# EAGLE design Connection (EAGLE 9.6.2)
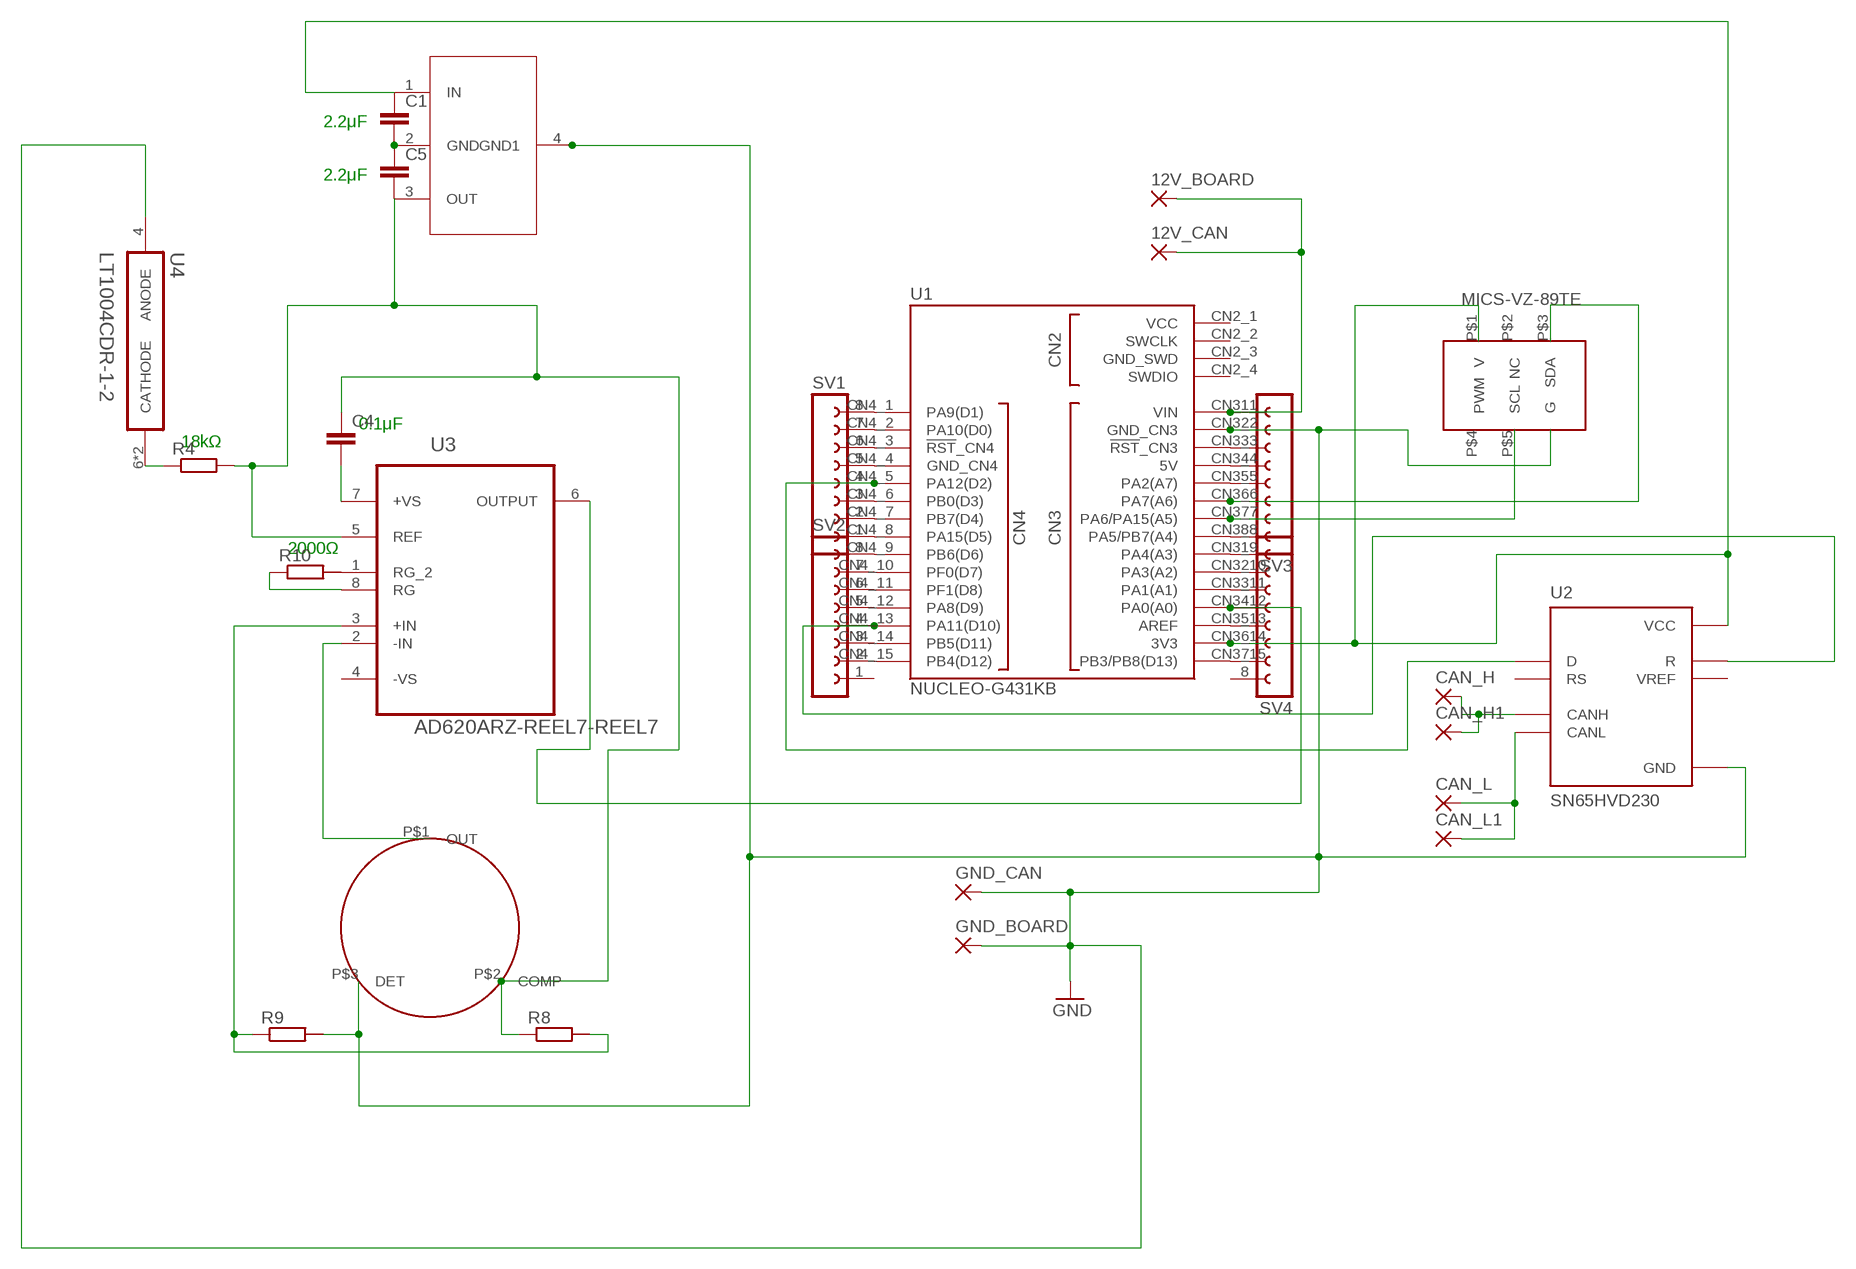
[diagram p0: schematic, sheet 1]

## Parts
12V_BOARD  1,6/0,8  [1,6/0,8]
12V_CAN  1,6/0,8  [1,6/0,8]
C1  C2,5-3  [C2.5-3]
C4  C2,5-3  [C2.5-3]
C5  C2,5-3  [C2.5-3]
CAN_H  1,6/0,8  [1,6/0,8]
CAN_H1  1,6/0,8  [1,6/0,8]
CAN_L  1,6/0,8  [1,6/0,8]
CAN_L1  1,6/0,8  [1,6/0,8]
GND_BOARD  1,6/0,8  [1,6/0,8]
GND_CAN  1,6/0,8  [1,6/0,8]
R4  R-EU_0207/10  [0207/10]
R8  R-EU_0207/10  [0207/10]
R9  R-EU_0207/10  [0207/10]
R10  R-EU_0207/10  [0207/10]
SV1  FE08-1  [FE08]
SV2  FE08-1  [FE08]
SV3  FE08-1  [FE08]
SV4  FE08-1  [FE08]
U1  NUCLEO-G431KB  [MODULE_NUCLEO-G431KB]
U2  SN65HVD230  [SOIC127P599X175-8N]
U3  AD620ARZ-REEL7-REEL7  [SOIC127P600X175-8N]
U4  LT1004CDR-1-2  [SOIC127P599X175-8N]
U$1  MP7227  [MP7227_FP]
U$2  MIC5233-3PIN  [SOT230P700X180-4N]
U$5  MICS-VZ-89TE  [MICS-VZ-89TE_FP]

## Nets
GND: GND_BOARD.1(P) GND_CAN.1(P) R9.2 SV3.2 U1.CN3_2(GND_CN3) U2.2(GND) U4.4(ANODE) U$1.P$3(DET) U$5.P$6(G)
N$1: 12V_BOARD.1(P) 12V_CAN.1(P) SV3.1 U1.CN3_1(VIN)
N$2: SV3.7 U1.CN3_7(PA6/PA15(A5)) U$5.P$5(SCL)
N$3: SV3.6 U1.CN3_6(PA7(A6)) U$5.P$3(SDA)
N$4: R4.1 U4.6(CATHODE) U4.8(CATHODE)
N$5: U3.2(-IN) U$1.P$1(OUT)
N$6: CAN_H1.1(P) CAN_H.1(P) U2.7(CANH)
N$7: CAN_L1.1(P) CAN_L.1(P) U2.6(CANL)
N$8: C1.1 SV4.6 U1.CN3_14(3V3) U2.3(VCC) U$2.1(IN) U$5.P$1(V)
N$9: SV1.4 U1.CN4_5(PA12(D2)) U2.1(D)
N$10: SV2.4 U1.CN4_13(PA11(D10)) U2.4(R)
N$11: R10.1 U3.8(RG)
N$12: C4.2 U3.7(+VS)
N$13: SV4.4 U1.CN3_12(PA0(A0)) U3.6(OUTPUT)
N$14: C5.1 U$2.2(GND)
N$15: R8.2 R9.1 U3.3(+IN)
N$16: R10.2 U3.1(RG_2)
N$17: C4.1 C5.2 R4.2 R8.1 U3.5(REF) U$1.P$2(COMP) U$2.3(OUT)
N$18: SV3.3 U1.CN3_3(!RST!_CN3)
N$19: SV3.4 U1.CN3_4(5V)
N$20: SV3.5 U1.CN3_5(PA2(A7))
N$21: SV3.8 U1.CN3_8(PA5/PB7(A4))
N$22: SV4.1 U1.CN3_9(PA4(A3))
N$23: SV4.2 U1.CN3_10(PA3(A2))
N$24: SV4.3 U1.CN3_11(PA1(A1))
N$25: SV4.5 U1.CN3_13(AREF)
N$26: SV4.7 U1.CN3_15(PB3/PB8(D13))
N$27: SV1.1 U1.CN4_8(PA15(D5))
N$28: SV1.2 U1.CN4_7(PB7(D4))
N$29: SV1.3 U1.CN4_6(PB0(D3))
N$30: SV1.5 U1.CN4_4(GND_CN4)
N$31: SV1.6 U1.CN4_3(!RST!_CN4)
N$32: SV1.7 U1.CN4_2(PA10(D0))
N$33: SV1.8 U1.CN4_1(PA9(D1))
N$34: SV2.2 U1.CN4_15(PB4(D12))
N$35: SV2.3 U1.CN4_14(PB5(D11))
N$36: SV2.5 U1.CN4_12(PA8(D9))
N$37: SV2.6 U1.CN4_11(PF1(D8))
N$38: SV2.7 U1.CN4_10(PF0(D7))
N$39: SV2.8 U1.CN4_9(PB6(D6))
N$40: C1.2 U$2.4(GND1)
Unconnected: SV2.1 SV4.8 U1.CN2_2(SWCLK) U1.CN2_4(SWDIO) U2.5(VREF) U2.8(RS) U$5.P$2(NC) U$5.P$4(PWM)

## Notes on the sheet
- 2.2μF
- 2.2μF
- 0.1μF
- 18kΩ
- 2000Ω

## Power pins joined to a net without a drawn wire
-VS: U3.4(-VS)
GND_SWD: U1.CN2_3(GND_SWD)
VCC: U1.CN2_1(VCC)

## Library data of the parts
12V_BOARD 12V_CAN CAN_H CAN_H1 CAN_L CAN_L1 GND_BOARD GND_CAN = wirepad:1,6/0,8: THROUGH-HOLE PAD
C1 C4 C5 = capacitor-wima:C: CAPACITOR naming: grid - package width
R4 R8-R10 = rcl:R-EU_: RESISTOR, European symbol; SPICEPREFIX: R
SV1-SV4 = con-lsta:FE08-1: FEMALE HEADER; OC_FARNELL: unknown; OC_NEWARK: unknown
U1 = NUCLEO-G431KB:NUCLEO-G431KB: Check availability <https://pricing.snapeda.com/parts/NUCLEO-G431KB/STMicroelectronics/view-part?ref=eda>; AVAILABILITY: In Stock; CHECK_PRICES: https://www.snapeda.com/parts/NUCLEO-G431KB/STMicroelectronics/view-part/?ref=eda; DESCRIPTION: STM32G431 Nucleo-32 STM32G4 ARM® Cortex®-M4 MCU 32-Bit Embedded Evaluation Board; MF: STMicroelectronics; MP: NUCLEO-G431KB; PACKAGE: None; PRICE: None; SNAPEDA_LINK: https://www.snapeda.com/parts/NUCLEO-G431KB/STMicroelectronics/view-part/?ref=snap
U2 = SN65HVD230:SN65HVD230: Check availability <https://pricing.snapeda.com/parts/SN65HVD230/Texas%20Instruments/view-part?ref=eda>; AVAILABILITY: In Stock; CHECK_PRICES: https://www.snapeda.com/parts/SN65HVD230/Texas+Instruments/view-part/?ref=eda; DESCRIPTION: 1/1 Transceiver Half CANbus 8-SOIC; MF: Texas Instruments; MP: SN65HVD230; PACKAGE: SOIC-8 Texas Instruments; PRICE: None; SNAPEDA_LINK: https://www.snapeda.com/parts/SN65HVD230/Texas+Instruments/view-part/?ref=snap
U3 = AD620ARZ-REEL7-REEL7:AD620ARZ-REEL7-REEL7: Check availability <https://pricing.snapeda.com/parts/AD620ARZ-REEL7/Analog%20Devices/view-part?ref=eda>; AVAILABILITY: In Stock; CHECK_PRICES: https://www.snapeda.com/parts/AD620ARZ-REEL7/Analog+Devices/view-part/?ref=eda; DESCRIPTION: Low Drift, Low Power Instrumentation Amp with Set Gains of 1 to 10000; MF: Analog Devices; MP: AD620ARZ-REEL7; PACKAGE: SOIC-8 Analog Devices; PRICE: None; PURCHASE-URL: https://www.snapeda.com/api/url_track_click_mouser/?unipart_id=48261&manufacturer=Analog Devices&part_name=AD620ARZ-REEL7&search_term=ad620; SNAPEDA_LINK: https://www.snapeda.com/parts/AD620ARZ-REEL7/Analog+Devices/view-part/?ref=snap
U4 = LT1004CDR-1-2:LT1004CDR-1-2: Check availability <https://pricing.snapeda.com/parts/LT1004CDR-1-2/Texas%20Instruments/view-part?ref=eda>; AVAILABILITY: In Stock; CHECK_PRICES: https://www.snapeda.com/parts/LT1004CDR-1-2/Texas+Instruments/view-part/?ref=eda; DESCRIPTION: 1.235-V, micropower integrated precision voltage reference; MF: Texas Instruments; MP: LT1004CDR-1-2; PACKAGE: SOIC-8 Texas Instruments; PRICE: None; SNAPEDA_LINK: https://www.snapeda.com/parts/LT1004CDR-1-2/Texas+Instruments/view-part/?ref=snap
U$1 = MP7227:MP7227
U$2 = MIC5233-3.3YS:MIC5233-3PIN
U$5 = MICS-VZ-89TE:MICS-VZ-89TE

## Board
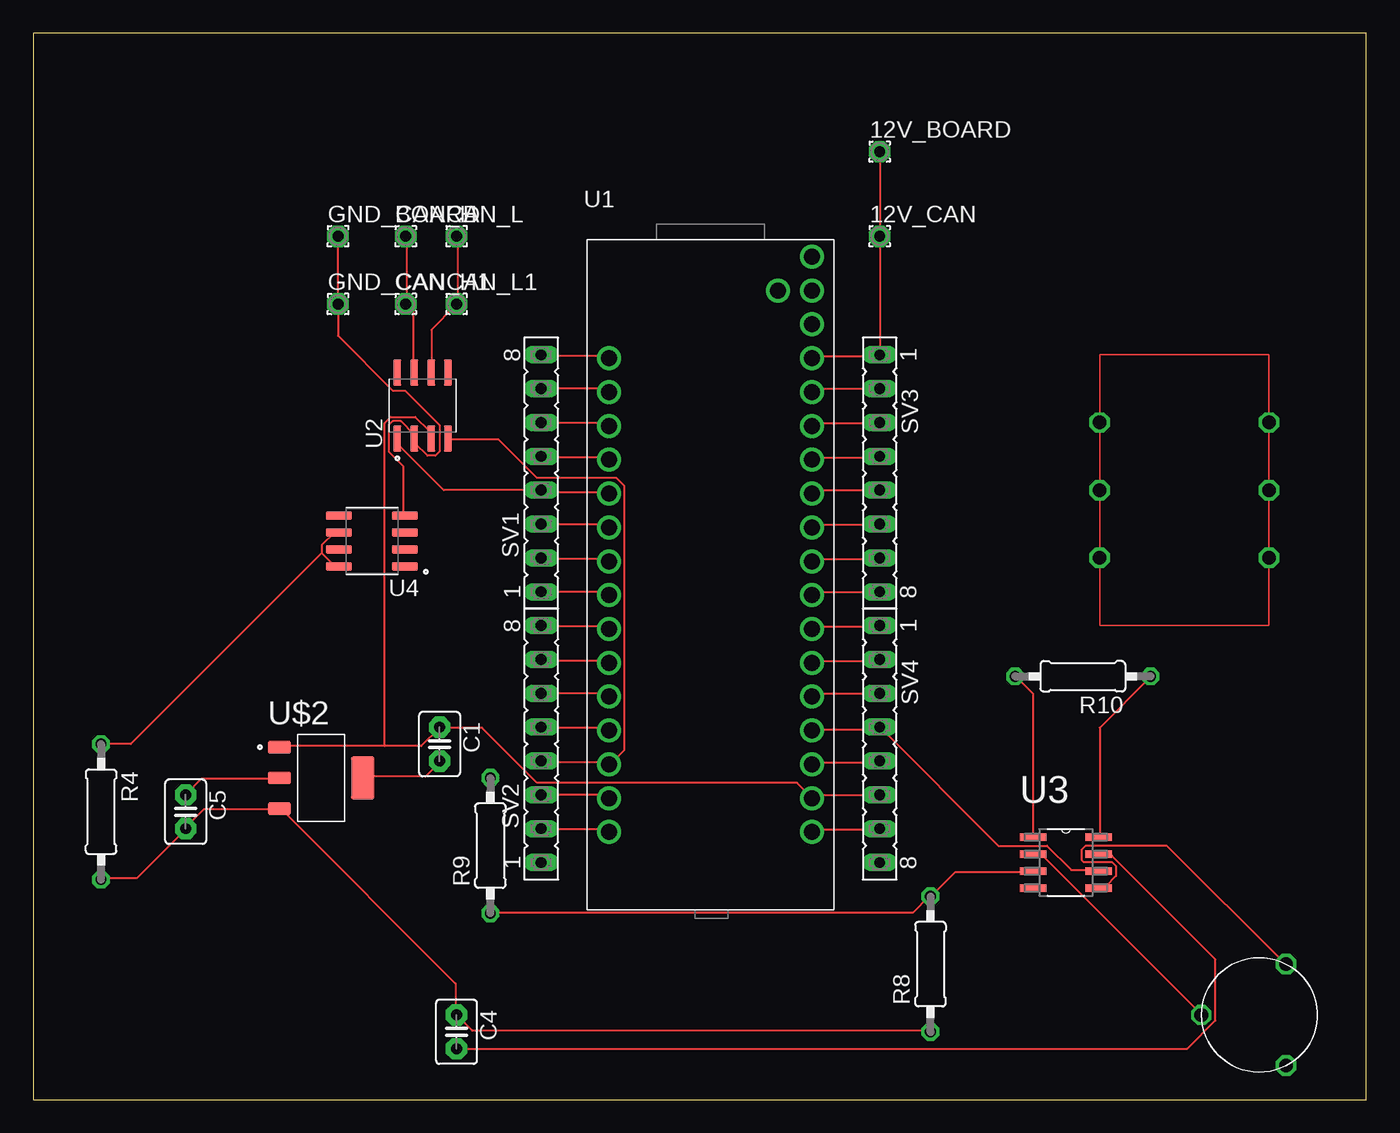
[diagram p1: board, top side]
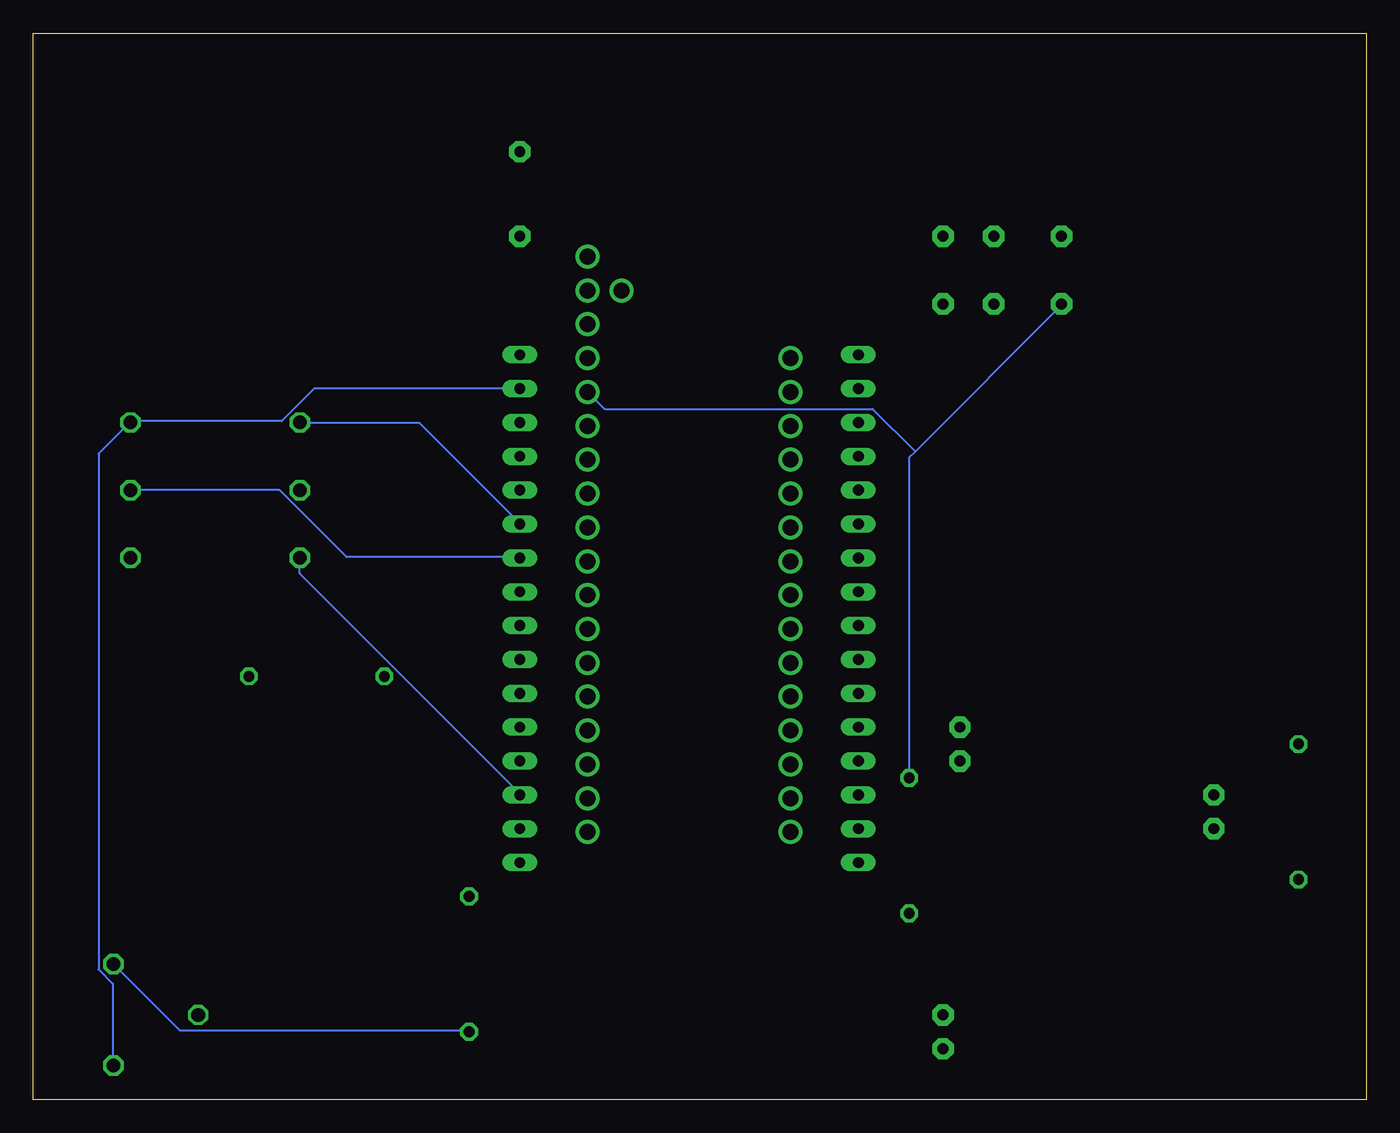
[diagram p2: board, bottom side, seen from below]

Size 100 x 80 mm. Coordinates in mm from the lower left corner, seen from the top.
Outline: 0,0 100,0 100,80 0,80 0,0
Copper layers (1*16): Top 0.035mm / dielectric 1.5mm / Bottom 0.035mm
Design rules "default": minimum track width 6mil, minimum drill 0.35mm, track to track 6mil, track to pad 6mil, pad to pad 6mil, via to via 6mil, smd to smd 6mil, copper to edge 40mil, drill to drill 6mil, minimum pad ring 10mil, minimum via ring 8mil, stop-mask expansion 4mil, vias tented up to drill 0mil, thermal gap 10mil

### Footprints (pad centres in the part's own frame; a part is rotated, then mirrored left to right if it is on the bottom)
1,6/0,8 = drill 0.813 pad 1.6 octagon: 1 0,0
C2.5-3 = drill 0.813 pad 1.6 octagon: 1 -1.27,0; 2 1.27,0
0207/10 = drill 0.813 octagon: 1 -5.08,0; 2 5.08,0
FE08 = drill 0.813 long: 1 -8.89,0; 2 -6.35,0; 3 -3.81,0; 4 -1.27,0; 5 1.27,0; 6 3.81,0; 7 6.35,0; 8 8.89,0
MODULE_NUCLEO-G431KB = drill 1.2: CN2_1 5.08,21.336; CN2_2 7.62,23.876; CN2_3 7.62,21.336; CN2_4 7.62,18.796; CN3_1 7.62,16.256; CN3_2 7.62,13.716; CN3_3 7.62,11.176; CN3_4 7.62,8.636; CN3_5 7.62,6.096; CN3_6 7.62,3.556; CN3_7 7.62,1.016; CN3_8 7.62,-1.524; CN3_9 7.62,-4.064; CN3_10 7.62,-6.604; CN3_11 7.62,-9.144; CN3_12 7.62,-11.684; CN3_13 7.62,-14.224; CN3_14 7.62,-16.764; CN3_15 7.62,-19.304; CN4_1 -7.62,16.256; CN4_2 -7.62,13.716; CN4_3 -7.62,11.176; CN4_4 -7.62,8.636; CN4_5 -7.62,6.096; CN4_6 -7.62,3.556; CN4_7 -7.62,1.016; CN4_8 -7.62,-1.524; CN4_9 -7.62,-4.064; CN4_10 -7.62,-6.604; CN4_11 -7.62,-9.144; CN4_12 -7.62,-11.684; CN4_13 -7.62,-14.224; CN4_14 -7.62,-16.764; CN4_15 -7.62,-19.304
SOIC127P599X175-8N = smd 1.97 x 0.6: 1 -2.47,1.905; 2 -2.47,0.635; 3 -2.47,-0.635; 4 -2.47,-1.905; 5 2.47,-1.905; 6 2.47,-0.635; 7 2.47,0.635; 8 2.47,1.905
SOIC127P600X175-8N = smd 1.981 x 0.559: 1 -2.464,1.905; 2 -2.464,0.635; 3 -2.464,-0.635; 4 -2.464,-1.905; 5 2.464,-1.905; 6 2.464,-0.635; 7 2.464,0.635; 8 2.464,1.905
MP7227_FP = drill 1.016 octagon: P$1 0,0; P$2 3.81,-6.35; P$3 -3.81,-6.35
SOT230P700X180-4N = smd 1.76 x 0.93: 1 -3.125,2.3; 2 -3.125,0; 3 -3.125,-2.3 | smd 1.76 x 3.19: 4 3.125,0
MICS-VZ-89TE_FP = drill 1.016 octagon: P$1 0,0; P$2 5.08,0; P$3 10.16,0; P$4 0,-12.7; P$5 5.08,-12.7; P$6 10.16,-12.7

### Placement (x,y rotation side)
12V_BOARD  63.5,71.12 0 top
12V_CAN  63.5,64.77 0 top
C1  30.48,26.67 270 top
C4  31.75,5.08 270 top
C5  11.43,21.59 270 top
CAN_H  27.94,64.77 0 top
CAN_H1  27.94,59.69 0 top
CAN_L  31.75,64.77 0 top
CAN_L1  31.75,59.69 0 top
GND_BOARD  22.86,64.77 0 top
GND_CAN  22.86,59.69 0 top
R4  5.08,21.59 270 top
R8  67.31,10.16 90 top
R9  34.29,19.05 90 top
R10  78.74,31.75 180 top
SV1  38.1,46.99 90 top
SV2  38.1,26.67 90 top
SV3  63.5,46.99 270 top
SV4  63.5,26.67 270 top
U1  50.8,39.37 0 top
U2  29.21,52.07 90 top
U3  77.47,17.78 0 top
U4  25.4,41.91 180 top
U$1  87.63,6.35 90 top
U$2  21.59,24.13 0 top
U$5  80.01,40.64 90 top

### Tracks (layer width: path | path; a pad name or v marks a point on that pad's centre or on a via)
GND
  Top 0.152: U4.4 27.74,43.89 27.74,47.55 26.67,48.62 26.67,50.6 26.98,50.9 27.58,50.9 28.5,49.99 28.5,49.68 U2.2 28.65,49.53 28.65,49.23 29.57,48.31 30.18,48.31 30.48,48.62 30.48,50.6 27.89,53.19 26.98,53.19 22.86,57.3 GND_CAN.1 GND_BOARD.1 | SV3.2 58.67,53.34 U1.CN3_2
  Bottom 0.152: R9.2 34.29,48.16 33.83,48.62 | 33.83,48.62 22.86,59.59 GND_CAN.1 | SV3.2 78.94,53.34 81.38,50.9 92.66,50.9 U$5.P$6 92.81,50.75 95.1,48.46 95.1,9.75 94.03,8.69 94.03,2.59 U$1.P$3 | 33.83,48.62 37.03,51.82 57.15,51.82 U1.CN3_2
N$1
  Top 0.152: U1.CN3_1 58.52,55.63 58.67,55.78 63.4,55.78 SV3.1 63.55,55.93 63.55,64.72 12V_CAN.1 12V_BOARD.1
N$2
  Top 0.152: SV3.7 63.4,40.54 58.67,40.54 58.52,40.39 U1.CN3_7
  Bottom 0.152: U$5.P$5 81.53,45.72 76.5,40.69 63.55,40.69 SV3.7
N$3
  Top 0.152: SV3.6 63.4,43.13 58.67,43.13 58.52,42.98 U1.CN3_6
  Bottom 0.152: U$5.P$3 80.01,50.75 71.02,50.75 63.55,43.28 SV3.6
N$4
  Top 0.152: 21.64,41 22.55,40.08 22.86,40.08 U4.8 | 21.64,41 21.64,41.6 22.55,42.52 22.86,42.52 U4.6 | R4.1 7.32,26.67 21.64,41
N$5
  Top 0.152: U3.2 75.13,18.29 75.74,18.29 87.63,6.4 U$1.P$1
N$6
  Top 0.152: U2.7 28.5,54.56 28.5,59.13 CAN_H1.1 28.04,59.74 28.04,64.77 CAN_H.1
N$7
  Top 0.152: U2.6 29.87,54.56 29.87,57.76 31.7,59.59 CAN_L1.1 31.85,59.74 31.85,64.77 CAN_L.1
N$8
  Top 0.152: 26.36,26.52 29.11,26.52 30.48,27.89 | 26.36,26.52 18.59,26.52 U$2.1 | 26.36,26.52 26.36,50.75 26.82,51.21 28.65,51.21 29.72,50.14 29.72,49.68 U2.3 | SV4.6 58.67,22.86 U1.CN3_14 58.37,22.71 57.3,23.77 37.8,23.77 33.68,27.89 30.48,27.89 | 30.48,27.89 C1.1
  Bottom 0.152: U$5.P$1 80.01,39.47 63.4,22.86 SV4.6
N$9
  Top 0.152: U2.1 27.43,49.53 27.43,49.07 30.79,45.72 SV1.4 38.25,45.57 43.13,45.57 U1.CN4_5
N$10
  Top 0.152: U2.4 31.24,49.53 34.9,49.53 37.8,46.63 43.74,46.63 44.35,46.02 44.35,26.21 43.28,25.15 U1.CN4_13 43.13,25.15 42.98,25.3 38.1,25.3 SV2.4
N$11
  Top 0.152: U3.8 80.01,19.81 80.01,27.89 83.82,31.7 R10.1
N$12
  Top 0.152: C4.2 86.56,3.81 88.7,5.94 88.7,10.52 80.92,18.29 80.01,18.29 U3.7
N$13
  Top 0.152: U3.6 79.86,17.22 77.88,17.22 76.05,19.05 72.39,19.05 SV4.4 63.4,27.89 63.25,27.74 58.52,27.74 U1.CN3_12
N$14
  Top 0.152: C5.1 12.65,24.08 18.44,24.08 U$2.2
N$15
  Top 0.152: U3.3 74.98,17.07 69.19,17.07 67.36,15.24 R8.2 67.21,15.24 65.99,14.02 34.29,14.02 R9.1
N$16
  Top 0.152: U3.1 74.98,19.81 74.98,30.48 73.76,31.7 R10.2
N$17
  Top 0.152: U3.5 80.01,16 80.47,16 81.23,16.76 81.23,17.53 80.92,17.83 78.79,17.83 78.64,17.98 78.64,18.75 78.94,19.05 85.04,19.05 93.88,10.21 U$1.P$2 | R4.2 5.18,16.61 7.77,16.61 11.43,20.27 C5.2 11.43,20.42 12.8,21.79 18.44,21.79 U$2.3 18.59,21.79 31.7,8.69 31.7,6.4 C4.1 32.92,5.18 67.21,5.18 R8.1
  Bottom 0.152: U$1.P$2 89,5.18 67.36,5.18 R8.1
N$18
  Top 0.152: SV3.3 63.4,50.75 58.67,50.75 58.52,50.6 U1.CN3_3
N$19
  Top 0.152: SV3.4 63.4,48.16 58.67,48.16 58.52,48.01 U1.CN3_4
N$20
  Top 0.152: SV3.5 58.67,45.72 U1.CN3_5
N$21
  Top 0.152: SV3.8 58.67,38.1 U1.CN3_8
N$22
  Top 0.152: SV4.1 63.4,35.51 58.67,35.51 58.52,35.36 U1.CN3_9
N$23
  Top 0.152: SV4.2 63.4,32.92 58.67,32.92 58.52,32.77 U1.CN3_10
N$24
  Top 0.152: SV4.3 58.67,30.48 U1.CN3_11
N$25
  Top 0.152: SV4.5 63.4,25.3 58.67,25.3 58.52,25.15 U1.CN3_13
N$26
  Top 0.152: SV4.7 63.4,20.27 58.67,20.27 58.52,20.12 U1.CN3_15
N$27
  Top 0.152: SV1.1 42.98,38.1 43.13,37.95 U1.CN4_8
N$28
  Top 0.152: SV1.2 38.1,40.54 42.98,40.54 43.13,40.39 U1.CN4_7
N$29
  Top 0.152: U1.CN4_6 42.98,43.13 38.1,43.13 SV1.3
N$30
  Top 0.152: SV1.5 38.1,48.16 42.98,48.16 43.13,48.01 U1.CN4_4
N$31
  Top 0.152: U1.CN4_3 42.98,50.75 38.1,50.75 SV1.6
N$32
  Top 0.152: SV1.7 42.98,53.34 43.13,53.19 U1.CN4_2
N$33
  Top 0.152: SV1.8 38.1,55.78 42.98,55.78 43.13,55.63 U1.CN4_1
N$34
  Top 0.152: U1.CN4_15 42.98,20.27 38.1,20.27 SV2.2
N$35
  Top 0.152: SV2.3 42.98,22.86 43.13,22.71 U1.CN4_14
N$36
  Top 0.152: U1.CN4_12 42.98,27.89 38.1,27.89 SV2.5
N$37
  Top 0.152: SV2.6 42.98,30.48 43.13,30.33 U1.CN4_11
N$38
  Top 0.152: SV2.7 38.1,32.92 42.98,32.92 43.13,32.77 U1.CN4_10
N$39
  Top 0.152: U1.CN4_9 42.98,35.51 38.1,35.51 SV2.8
N$40
  Top 0.152: U$2.4 24.84,24.23 29.41,24.23 30.48,25.3 C1.2